# Altium project distance.PrjPCB
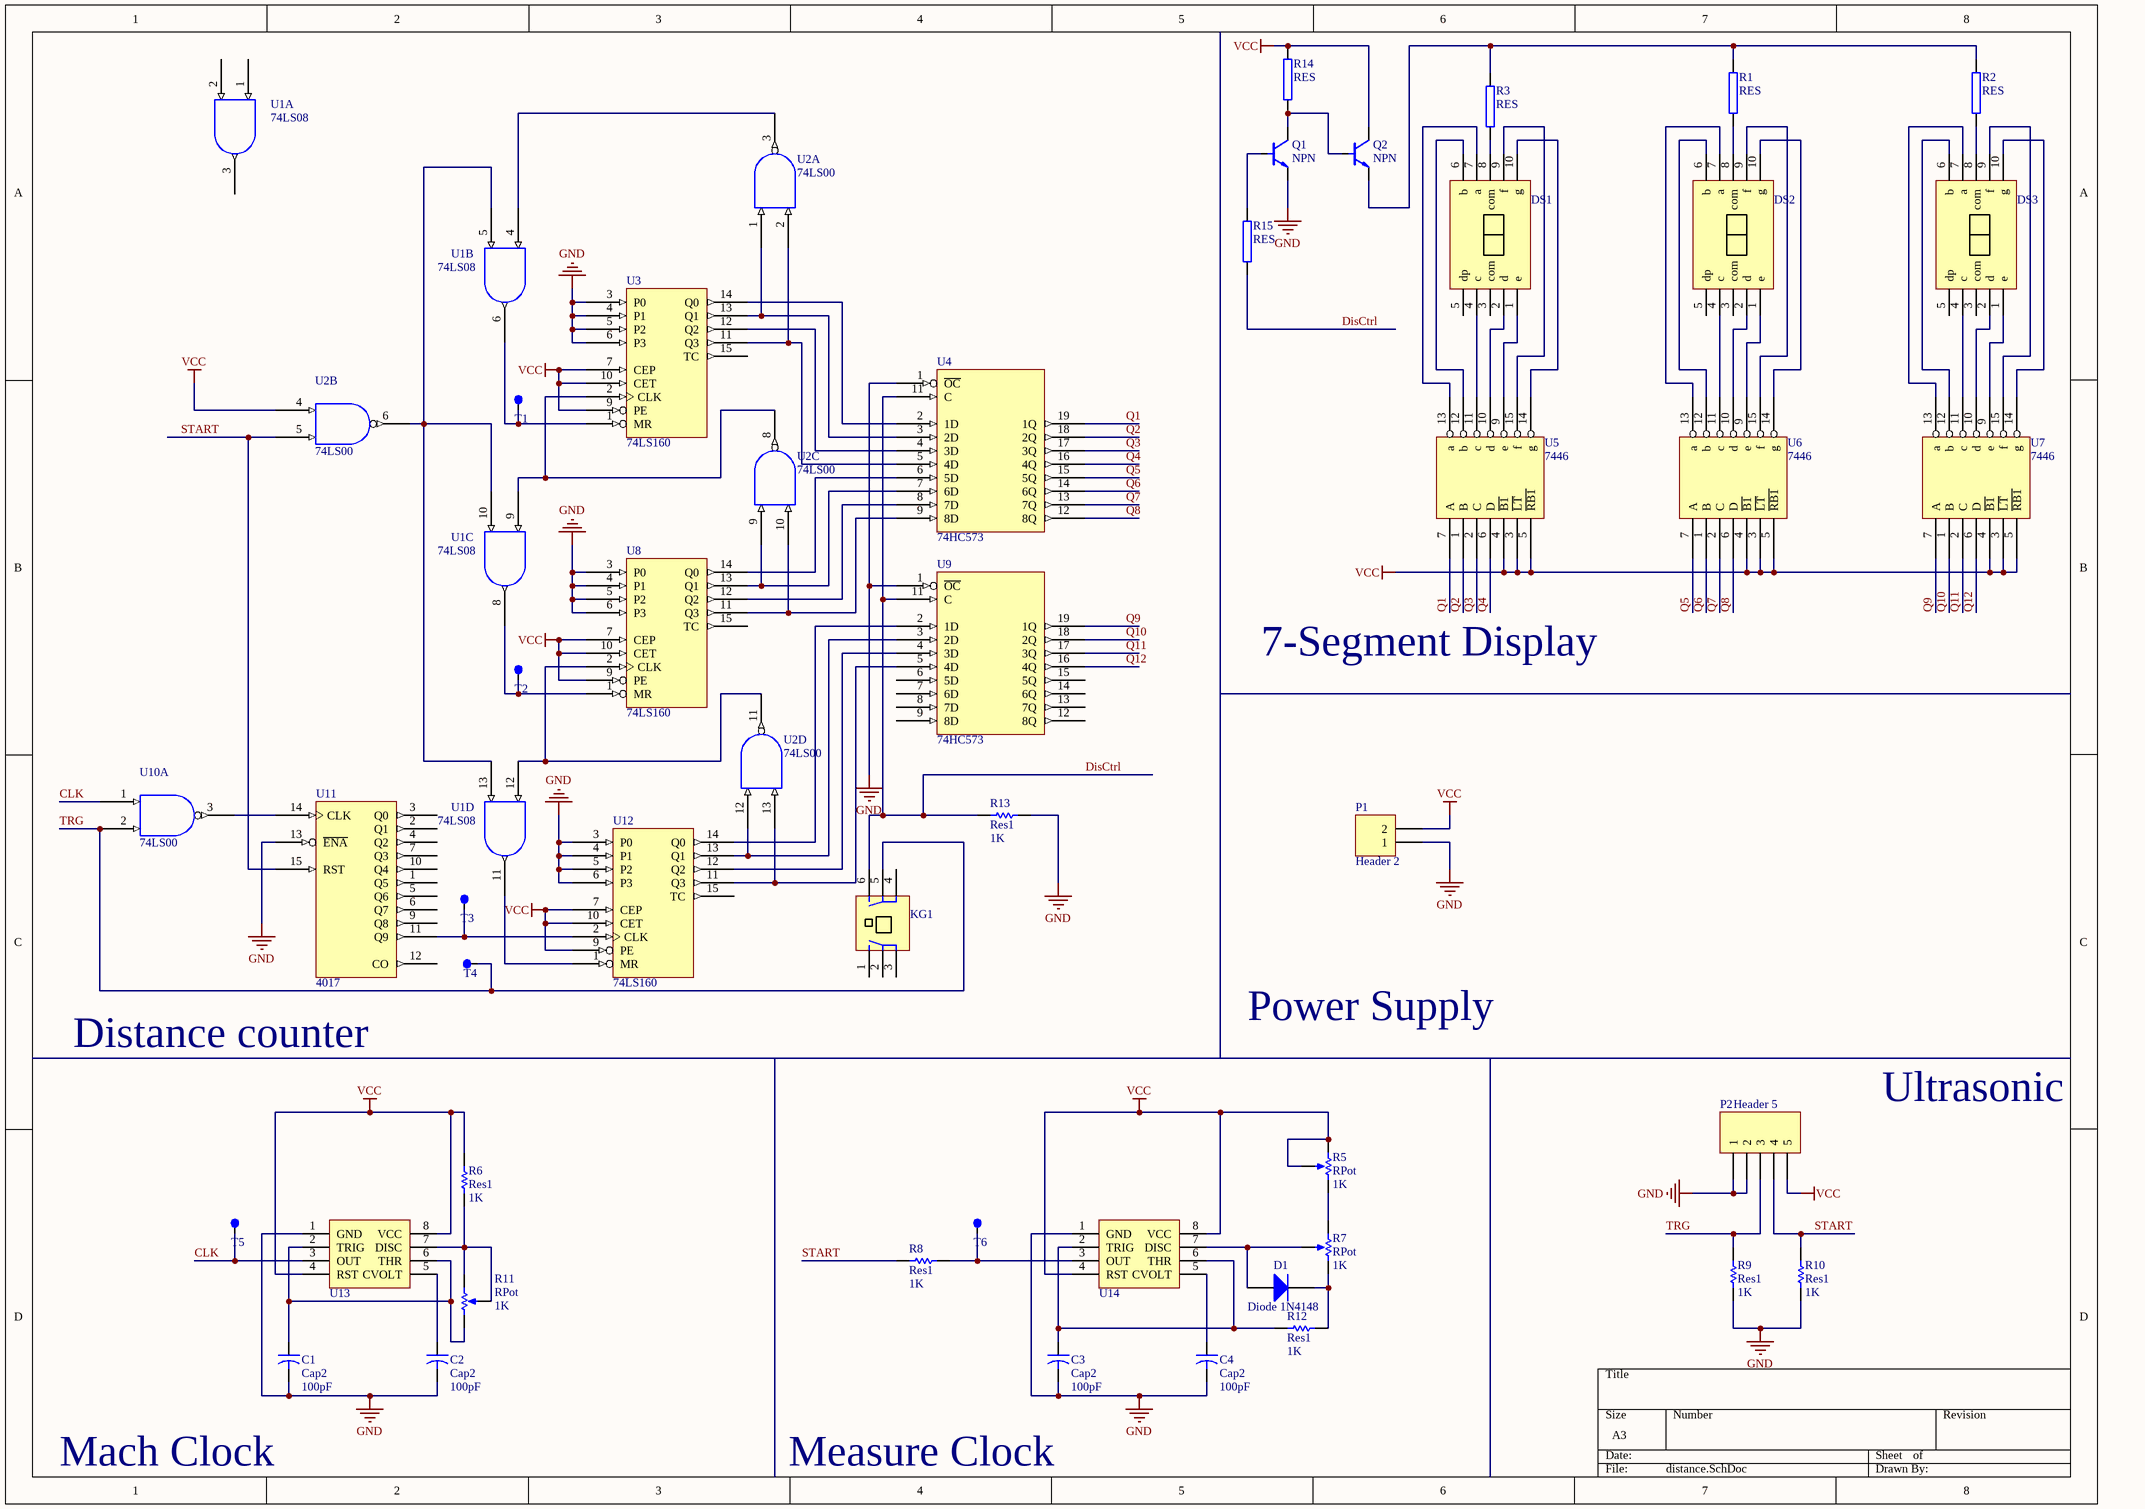
[diagram p0: distance.SchDoc]
1 sheet, 47 parts. Net scope: global (net labels, ports and power ports of the same name join across sheets).
Board files: PCB1.PcbDoc, Makise.PcbDoc, line.PcbDoc, kizunei.PcbDoc, kizunei2.PcbDoc

## Sheet distance.SchDoc
size A3

### Parts
C1  Cap2  value 100pF  [CAPR5-4X5]
C2  Cap2  value 100pF  [CAPR5-4X5]
C3  Cap2  value 100pF  [CAPR5-4X5]
C4  Cap2  value 100pF  [CAPR5-4X5]
D1  Diode 1N4148  [DO-35]
DS1  0.56一位共阳数码管  [0.56 一位共阳数码管]  (value not drawn)
DS2  0.56一位共阳数码管  [0.56 一位共阳数码管]  (value not drawn)
DS3  0.56一位共阳数码管  [0.56 一位共阳数码管]  (value not drawn)
KG1  7*7自锁开关  [7*7 自锁开关]  (value not drawn)
P1  Header 2  [DG1282-5.0]
P2  Header 5  [HDR1X5]
Q1  NPN  [TO92]
Q2  NPN  [TO92]
R1  RES  [AXIAL0.4]
R2  RES  [AXIAL0.4]
R3  RES  [AXIAL0.4]
R5  RPot  value 1K  [VR5]
R6  Res1  value 1K  [AXIAL-0.3]
R7  RPot  value 1K  [VR5]
R8  Res1  value 1K  [AXIAL-0.3]
R9  Res1  value 1K  [AXIAL-0.3]
R10  Res1  value 1K  [AXIAL-0.3]
R11  RPot  value 1K  [VR5]
R12  Res1  value 1K  [AXIAL-0.3]
R13  Res1  value 1K  [AXIAL-0.3]
R14  RES  [AXIAL0.4]
R15  RES  [AXIAL0.4]
T1  1 测试点  [SIP1-1*1]  (value not drawn)
T2  1 测试点  [SIP1-1*1]  (value not drawn)
T3  1 测试点  [SIP1-1*1]  (value not drawn)
T4  1 测试点  [SIP1-1*1]  (value not drawn)
T5  1 测试点  [SIP1-1*1]  (value not drawn)
T6  1 测试点  [SIP1-1*1]  (value not drawn)
U1  74LS08  [DIP-14]  (parts A,B,C,D of 4)
U2  74LS00  [DIP-14]  (parts A,B,C,D of 4)
U3  74LS160  [DIP-16]
U4  74HC573  [DIP20-300]
U5  7446  [DIP-16]
U6  7446  [DIP-16]
U7  7446  [DIP-16]
U8  74LS160  [DIP-16]
U9  74HC573  [DIP20-300]
U10  74LS00  [DIP-14]  (part A of 4)
U11  4017  [DIP-16]
U12  74LS160  [DIP-16]
U13  NE555  [DIP8]  (value not drawn)
U14  NE555  [DIP8]  (value not drawn)

### Nets
GND: C1.2 C2.2 C3.2 C4.2 P1.1 P2.1 P2.2 Q1.1(e) R9.2 R10.2 R13.1 U1.7(GND) U2.7(GND) U3.3(P0) U3.4(P1) U3.5(P2) U3.6(P3) U3.8(GND) U4.1(~{OC}) U4.10(GND) U5.8(GND) U6.8(GND) U7.8(GND) U8.3(P0) U8.4(P1) U8.5(P2) U8.6(P3) U8.8(GND) U9.1(~{OC}) U9.10(GND) U10.7(GND) U11.8(GND) U11.13(~{ENA}) U12.3(P0) U12.4(P1) U12.5(P2) U12.6(P3) U12.8(GND) U13.1(GND) U14.1(GND)
VCC: P1.2 P2.5 Q2.2(c) R5.2(TAP) R5.3(TOP) R6.2 R14.2 U1.14(VCC) U2.4 U2.14(VCC) U3.7(CEP) U3.9(PE) U3.10(CET) U3.16(VCC) U4.20(VCC) U5.3(~{LT}) U5.4(~{B1}) U5.5(~{RB1}) U5.16(VCC) U6.3(~{LT}) U6.4(~{B1}) U6.5(~{RB1}) U6.16(VCC) U7.3(~{LT}) U7.4(~{B1}) U7.5(~{RB1}) U7.16(VCC) U8.7(CEP) U8.9(PE) U8.10(CET) U8.16(VCC) U9.20(VCC) U10.14(VCC) U11.16(VCC) U12.7(CEP) U12.9(PE) U12.10(CET) U12.16(VCC) U13.4(RST) U13.8(VCC) U14.4(RST) U14.8(VCC)
CLK: T5.1 U10.1 U13.3(OUT)
DisCtrl: KG1.6 R13.2 R15.1 U4.11(C) U9.11(C)
Q1: U4.19(1Q) U5.7(A)
Q2: U4.18(2Q) U5.1(B)
Q3: U4.17(3Q) U5.2(C)
Q4: U4.16(4Q) U5.6(D)
Q5: U4.15(5Q) U6.7(A)
Q6: U4.14(6Q) U6.1(B)
Q7: U4.13(7Q) U6.2(C)
Q8: U4.12(8Q) U6.6(D)
Q9: U7.7(A) U9.19(1Q)
Q10: U7.1(B) U9.18(2Q)
Q11: U7.2(C) U9.17(3Q)
Q12: U7.6(D) U9.16(4Q)
START: P2.4 R8.1 R10.1 U2.5 U11.15(RST)
TRG: KG1.5 P2.3 R9.1 T4.1 U10.2
NetC1_1: C1.1 R11.3(TOP) U13.2(TRIG) U13.6(THR)
NetC2_1: C2.1 U13.5(CVOLT)
NetC3_1: C3.1 R12.2 U14.2(TRIG) U14.6(THR)
NetC4_1: C4.1 U14.5(CVOLT)
NetD1_1: D1.1(A) R7.2(TAP) U14.7(DISC)
NetD1_2: D1.2(K) R7.1(BOT) R12.1
NetDS1_1: DS1.1(e) U5.9(e)
NetDS1_2: DS1.2(d) U5.10(d)
NetDS1_4: DS1.4(c) U5.11(c)
NetDS1_6: DS1.6(b) U5.12(b)
NetDS1_7: DS1.7(a) U5.13(a)
NetDS1_8: DS1.8(com) R3.1
NetDS1_9: DS1.9(f) U5.15(f)
NetDS1_10: DS1.10(g) U5.14(g)
NetDS2_1: DS2.1(e) U6.9(e)
NetDS2_2: DS2.2(d) U6.10(d)
NetDS2_4: DS2.4(c) U6.11(c)
NetDS2_6: DS2.6(b) U6.12(b)
NetDS2_7: DS2.7(a) U6.13(a)
NetDS2_8: DS2.8(com) R1.1
NetDS2_9: DS2.9(f) U6.15(f)
NetDS2_10: DS2.10(g) U6.14(g)
NetDS3_1: DS3.1(e) U7.9(e)
NetDS3_2: DS3.2(d) U7.10(d)
NetDS3_4: DS3.4(c) U7.11(c)
NetDS3_6: DS3.6(b) U7.12(b)
NetDS3_7: DS3.7(a) U7.13(a)
NetDS3_8: DS3.8(com) R2.1
NetDS3_9: DS3.9(f) U7.15(f)
NetDS3_10: DS3.10(g) U7.14(g)
NetQ1_2: Q1.2(c) Q2.3(b) R14.1
NetQ1_3: Q1.3(b) R15.2
NetQ2_1: Q2.1(e) R1.2 R2.2 R3.2
NetR5_1: R5.1(BOT) R7.3(TOP)
NetR6_1: R6.1 R11.1(BOT) R11.2(TAP) U13.7(DISC)
NetR8_2: R8.2 T6.1 U14.3(OUT)
NetT1_1: T1.1 U1.6 U3.1(MR)
NetT2_1: T2.1 U1.8 U8.1(MR)
NetT3_1: T3.1 U11.11(Q9) U12.2(CLK)
NetU1_4: U1.4 U2.3
NetU1_5: U1.5 U1.10 U1.13 U2.6
NetU1_9: U1.9 U2.8 U3.2(CLK)
NetU1_11: U1.11 U12.1(MR)
NetU1_12: U1.12 U2.11 U8.2(CLK)
NetU2_1: U2.1 U3.13(Q1) U4.3(2D)
NetU2_2: U2.2 U3.11(Q3) U4.5(4D)
NetU2_9: U2.9 U4.7(6D) U8.13(Q1)
NetU2_10: U2.10 U4.9(8D) U8.11(Q3)
NetU2_12: U2.12 U9.3(2D) U12.13(Q1)
NetU2_13: U2.13 U9.5(4D) U12.11(Q3)
NetU3_12: U3.12(Q2) U4.4(3D)
NetU3_14: U3.14(Q0) U4.2(1D)
NetU4_6: U4.6(5D) U8.14(Q0)
NetU4_8: U4.8(7D) U8.12(Q2)
NetU9_2: U9.2(1D) U12.14(Q0)
NetU9_4: U9.4(3D) U12.12(Q2)
NetU10_3: U10.3 U11.14(CLK)

Not connected (* = marked no-connect by the designer): DS1 3(com) 5(dp); DS2 3(com) 5(dp); DS3 3(com) 5(dp); KG1 1(0) 2(1) 3(2) 4(3); U1 1 2 3; U3 15(TC); U8 15(TC); U9 6(5D) 7(6D) 8(7D) 9(8D) 12(8Q) 13(7Q) 14(6Q) 15(5Q); U11 1(Q5) 2(Q1) 3(Q0) 4(Q2) 5(Q6) 6(Q7) 7(Q3) 9(Q8) 10(Q4) 12(CO); U12 15(TC)

### Notes on the sheet
- 7-Segment Display
- Distance counter
- Power Supply
- Ultrasonic
- Mach Clock
- Measure Clock

### Library data of the parts
C1-C4 = Cap2: Capacitor; Published: 23-Sep-2002; PackageReference: CAPR5-4X5; Publisher: Altium Limited; PackageDescription: Capacitor; 2 Leads
D1 = Diode 1N4148: High Conductance Fast Diode; Published: 8-Jun-2000; LatestRevisionDate: 17-Jul-2002; LatestRevisionNote: Re-released for DXP Platform.; DatasheetVersion: 1997; PackageReference: DO-35; Publisher: Altium Limited; PackageDescription: Diode, Axial; Body 3.8 x 1.9 mm (LxDia. max), Lead Dia. 0.53 mm (max); Code_JEDEC: DO-204-AH; ComponentLink1Description: Manufacturer Link; ComponentLink1URL: http://www.fairchildsemi.com/; ComponentLink2Description: Datasheet; ComponentLink2URL: http://www.fairchildsemi.com/ds/1N%2F1N4148.pdf
P1 = Header 2: Header, 2-Pin; LatestRevisionDate: 17-Jul-2002; LatestRevisionNote: Re-released for DXP Platform.; Publisher: Altium Limited
P2 = Header 5: Header, 5-Pin; LatestRevisionDate: 17-Jul-2002; LatestRevisionNote: Re-released for DXP Platform.; Publisher: Altium Limited
R5 R7 R11 = RPot: Potentiometer; Sim Note: Enter the Resistance value and the set point into parameter fields.; Set Position: 0.5; Published: 8-Jun-2000; LatestRevisionDate: 17-Jul-2002; LatestRevisionNote: Re-released for DXP Platform.; PackageReference: VR5; Publisher: Altium Limited; PackageDescription: Variable Resistor, Thru-Hole; 3 Leads
R6 R8-R10 R12 R13 = Res1: Resistor; Published: 8-Jun-2000; LatestRevisionDate: 17-Jul-2002; LatestRevisionNote: Re-released for DXP Platform.; PackageReference: AXIAL-0.3; Publisher: Altium Limited; PackageDescription: Axial Device, Thru-Hole; 2 Leads; 0.3 in Pin Spacing